# Altium project BLDCControllerDev.PrjPcb
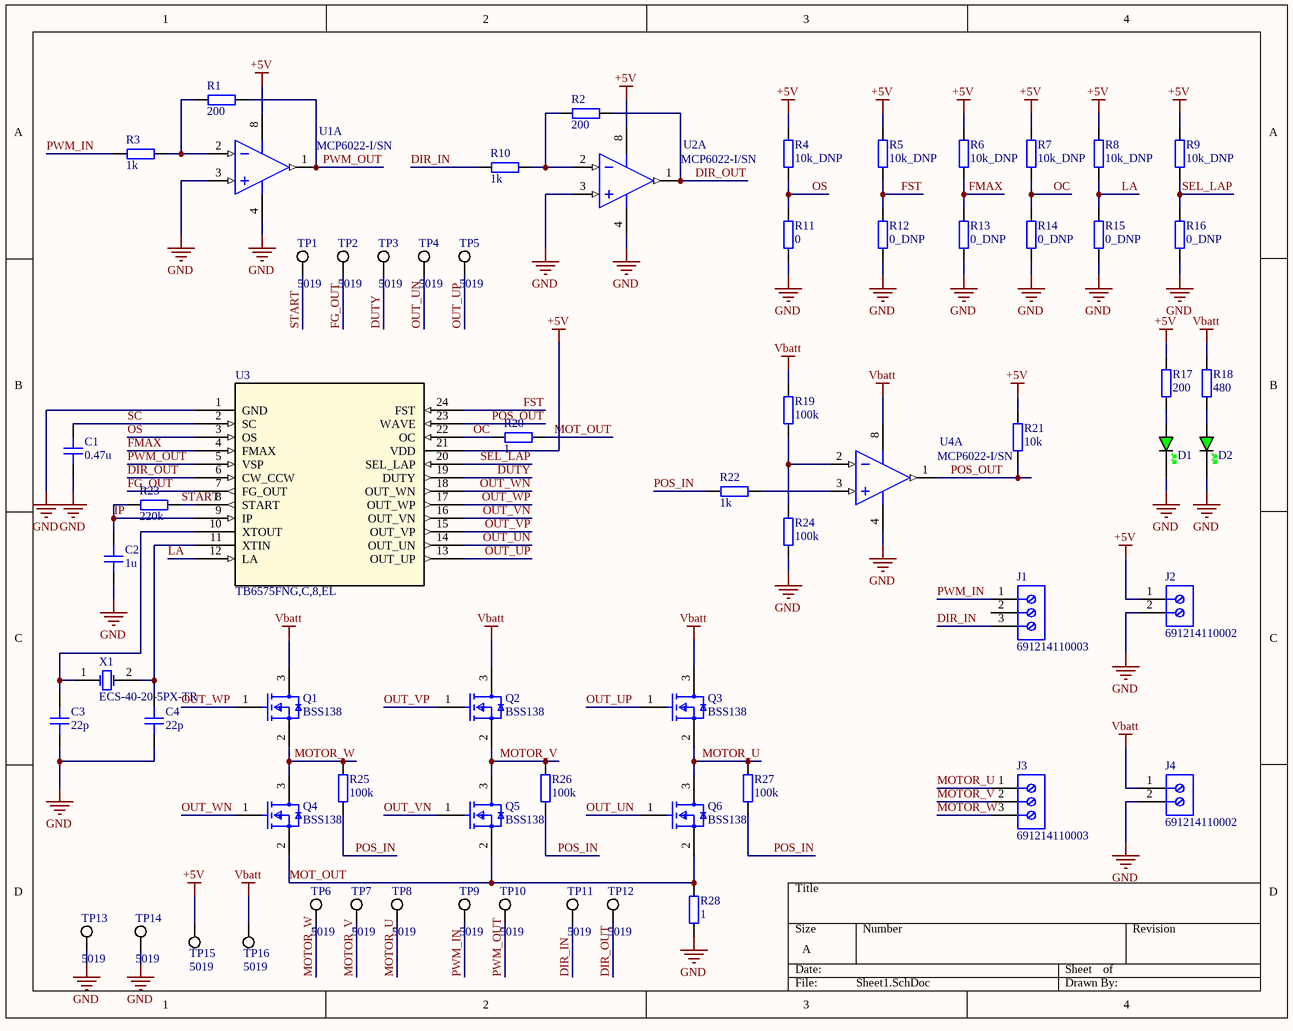
[diagram p0: Sheet1.SchDoc]
1 sheet, 65 parts. Net scope: global (net labels, ports and power ports of the same name join across sheets).
Board file: BLDC.PcbDoc

## Sheet Sheet1.SchDoc
size A; SheetNumber: 1; SheetTotal: 1; SPICEModelCacheHQCTBZKL: <root> / <DocumentId>HQCTBZKL</DocumentId> / <CacheFrame Number="0"> / <Model Name="mcp6021" Kind="CKT"> / <Text>.SUBCKT MCP6021 1 2 3 4 5 / *               | | | | | / *               | | | | Output / *               | | | Negative Supply / *               | | Positive Supply / *               | Inverting Input / *               Non-inverting Input / * / ******************************************************************************** / * Software License Agreement                                                   * / *                                                                              * / * The software supplied herewith by Microchip Technology Incorporated (the     * / * 'Company') is intended and supplied to you, the Company's customer, for use  * / * soley and exclusively on Microchip products.                                 * / *                                                                              * / * The software is owned by the Company and/or its supplier, and is protected   * / * under applicable copyright laws. All rights are reserved. Any use in         * / * violation of the foregoing restrictions may subject the user to criminal     * / * sanctions under applicable laws, as well as to civil liability for the       * / * breach of the terms and conditions of this license.                          * / *                                                                              * / * THIS SOFTWARE IS PROVIDED IN AN 'AS IS' CONDITION. NO WARRANTIES, WHETHER    * / * EXPRESS, IMPLIED OR STATUTORY, INCLUDING, BUT NOT LIMITED TO, IMPLIED        * / * WARRANTIES OF MERCHANTABILITY AND FITNESS FOR A PARTICULAR PURPOSE APPLY TO  * / * THIS SOFTWARE. THE COMPANY SHALL NOT, IN ANY CIRCUMSTANCES, BE LIABLE FOR    * / * SPECIAL, INCIDENTAL OR CONSEQUENTIAL DAMAGES, FOR ANY REASON WHATSOEVER.     * / ******************************************************************************** / * / * The following op-amps are covered by this model: / *      MCP6021,MCP6021R,MCP6022,MCP6023,MCP6024 / * / * Revision History: / *     REV A: 10-Feb-01, KEB (created model) / *     REV B: 27-Aug-06, HNV (added over temperature, improved output stage, / *                            fixed overdrive recovery time) / *			    (MC_RQ, 27-Aug-06, Level 1.17) / * / * Recommendations: / *      Use PSPICE (other simulators may require translation) / *      For a quick, effective design, use a combination of: data sheet / *            specs, bench testing, and simulations with this macromodel / *      For high impedance circuits, set GMIN=100F in the .OPTIONS statement / * / * Supported: / *      Typical performance for temperature range (-40 to 125) degrees Celsius / *      DC, AC, Transient, and Noise analyses. / *      Most specs, including: offsets, DC PSRR, DC CMRR, input impedance, / *            open loop gain, voltage ranges, supply current, ... , etc. / *      Temperature effects for Ibias, Iquiescent, Iout short circuit / *            current, Vsat on both rails, Slew Rate vs. Temp and P.S. / * / * Not Supported: / *      Chip select (MCP6023) / *      Some Variation in specs vs. Power Supply Voltage / *      Monte Carlo (Vos, Ib), Process variation / *      Distortion (detailed non-linear behavior) / *      Behavior outside normal operating region / * / * Input Stage / V10  3 10 -500M / R10 10 11 690K / R11 10 12 690K / G10 10 11 10 11 288U / G11 10 12 10 12 288U / C11 11 12 0.2P / C12  1  0 6.00P / E12 71 14 POLY(4) 20 0 21 0 26 0 27 0   0 1 1 1 1 / G12 1 0 62 0 1m / M12 11 14 15 15 NMI / G13 1 2 62 0 .08m / M14 12 2 15 15 NMI / G14 2 0 62 0 1m / C14  2  0 6.00P / I15 15 4 225.0U / V16 16 4 -300M / GD16 16 1 TABLE {V(16,1)} ((-100,-1p)(0,0)(1m,1u)(2m,1m)) / V13 3 13 -300M / GD13 2 13 TABLE {V(2,13)} ((-100,-1p)(0,0)(1m,1u)(2m,1m)) / R71  1  0 20.0E12 / R72  2  0 20.0E12 / R73  1  2 20.0E12 / I80  1  2 500E-15 / * / * Noise, PSRR, and CMRR / I20 21 20 423U / D20 20  0 DN1 / D21  0 21 DN1 / G26  0 26 POLY(2) 3 0 4 0   0.00 -31.6U -79.4U / R26 26  0 1 / E271 275 0 1 0 1 / E272 276 0 2 0 1 / R271 275 271 37k / R272 276 272 37k / R273 271 0 1k / R274 272 0 1k / C271 275 271 3p / C272 276 272 3p / G27  0 27 POLY(2) 271 0 272 0  -327U 500U 500U / R27 27  0 1 / * / * Open Loop Gain, Slew Rate / G30  0 30 12 11 1 / R30 30  0 1.00K / G31 0 31 3 4 4 / I31 0 31 DC 76.9 / R31 31  0 1 TC=2.34M,-4.57U / GD31 30 0 TABLE {V(30,31)} ((-100,-1n)(0,0)(1m,0.1)(2m,2)) / G32 32 0 3 4 10 / I32 32 0 DC 65 / R32 32  0 1 TC=1.80M,-3.97U / GD32 0 30 TABLE {V(30,32)} ((-2m,2)(-1m,0.1)(0,0)(100,-1n)) / G33  0 33 30 0 1m / R33  33 0 1K / G34  0 34 33 0 1.00 / R34  34 0 1K / C34  34 0 14U / G37  0 37 34 0 1m / R37  37 0 1K / C37  37 0 6P / G38  0 38 37 0 1m / R38  39 0 1K / L38  38 39 31U / E38  35 0 38 0 1 / G35 33 0 TABLE {V(35,3)} ((-1,-1n)(0,0)(50.0,1n))(55.0,1)) / G36 33 0 TABLE {V(35,4)} ((-55.0,-1)((-50.0,-1n)(0,0)(1,1n)) / * / * Output Stage / R80 50 0 100MEG / G50 0 50 57 96 2 / R58 57  96 0.50 / R57 57  0 500 / C58  5  0 2.00P / G57  0 57 POLY(3) 3 0 4 0 35 0   0 0.75M 0.8M 2.00M / GD55 55 57 TABLE {V(55,57)} ((-2m,-1)(-1m,-1m)(0,0)(10,1n)) / GD56 57 56 TABLE {V(57,56)} ((-2m,-1)(-1m,-1m)(0,0)(10,1n)) / E55 55  0 POLY(2) 3 0 51 0 -1.4M 1 -19.1M / E56 56  0 POLY(2) 4 0 52 0 3.5M 1 -19.0M / R51 51 0 1k / R52 52 0 1k / GD51 50 51 TABLE {V(50,51)} ((-10,-1n)(0,0)(1m,1m)(2m,1)) / GD52 50 52 TABLE {V(50,52)}  ((-2m,-1)(-1m,-1m)(0,0)(10,1n)) / G53  3  0 POLY(1) 51 0  -50.0U 1M / G54  0  4 POLY(1) 52 0  -50.0U -1M / * / * Current Limit / G99 96 5 99 0 1 / R98 0 98 1 TC=3.18M,-842N / G97 0 98 TABLE { V(96,5) } ((-11.0,-23.0M)(-1.00M,-22.7M)(0,0)(1.00M,22.7M)(11.0,23.0M)) / E97 99 0 VALUE { V(98)*((V(3)-V(4))*0.00 + 1.00)} / D98 4 5 DESD / D99 5 3 DESD / * / * Temperature / Voltage Sensitive IQuiscent / R61 0 61 1 TC=2.62M,-1.92U / G61 3 4 61 0 1 / G60 0 61 TABLE {V(3, 4)} / + ((0,0)(900M,9.2U)(1.1,50U)(1.3,240U) / + (2.1,870U)(2.2,900U)(5.5,980U)) / * / * Temperature Sensistive offset voltage / I73 0 70 DC 1uA / R74 0 70 1 TC=3.5 / E75 1 71 70 0 1 / * / * Temp Sensistive IBias / I62 0 62 DC 1uA / R62 0 62 REXP  245U / * / * Models / .MODEL NMI NMOS(L=2.00U W=42.0U KP=20.0U LEVEL=1 ) / .MODEL DESD  D   N=1 IS=1.00E-15 / .MODEL DN1 D   IS=1P KF=12.5F AF=1 / .MODEL REXP RES TCE= 9.16 / .ENDS MCP6021</Text> / </Model> / </CacheFrame> / </root>

### Parts
C1  0.47u  [CAP_0805]
C2  1u  [CAP_0805]
C3  22p  [CAP_0805]
C4  22p  [CAP_0805]
D1  GREEN  [LED_0805_GREEN]  (value not drawn)
D2  GREEN  [LED_0805_GREEN]  (value not drawn)
J1  691214110003  [691214110003]
J2  691214110002  [691214110002]
J3  691214110003  [691214110003]
J4  691214110002  [691214110002]
Q1  BSS138  [FP-318-08-IPC_B]
Q2  BSS138  [FP-318-08-IPC_B]
Q3  BSS138  [FP-318-08-IPC_B]
Q4  BSS138  [FP-318-08-IPC_B]
Q5  BSS138  [FP-318-08-IPC_B]
Q6  BSS138  [FP-318-08-IPC_B]
R1  200  [RES_0805]
R2  200  [RES_0805]
R3  1k  [RES_0805]
R4  10k_DNP  [RES_0805]
R5  10k_DNP  [RES_0805]
R6  10k_DNP  [RES_0805]
R7  10k_DNP  [RES_0805]
R8  10k_DNP  [RES_0805]
R9  10k_DNP  [RES_0805]
R10  1k  [RES_0805]
R11  0  [RES_0805]
R12  0_DNP  [RES_0805]
R13  0_DNP  [RES_0805]
R14  0_DNP  [RES_0805]
R15  0_DNP  [RES_0805]
R16  0_DNP  [RES_0805]
R17  200  [RES_0805]
R18  480  [RES_0805]
R19  100k  [RES_0805]
R20  1  [RES_0805]
R21  10k  [RES_0805]
R22  1k  [RES_0805]
R23  220k  [RES_0805]
R24  100k  [RES_0805]
R25  100k  [RES_0805]
R26  100k  [RES_0805]
R27  100k  [RES_0805]
R28  1  [RES_0805]
TP1  5019  [KSTN-5019_V]
TP2  5019  [KSTN-5019_V]
TP3  5019  [KSTN-5019_V]
TP4  5019  [KSTN-5019_V]
TP5  5019  [KSTN-5019_V]
TP6  5019  [KSTN-5019_V]
TP7  5019  [KSTN-5019_V]
TP8  5019  [KSTN-5019_V]
TP9  5019  [KSTN-5019_V]
TP10  5019  [KSTN-5019_V]
TP11  5019  [KSTN-5019_V]
TP12  5019  [KSTN-5019_V]
TP13  5019  [KSTN-5019_V]
TP14  5019  [KSTN-5019_V]
TP15  5019  [KSTN-5019_V]
TP16  5019  [KSTN-5019_V]
U1  MCP6022-I/SN  [SOIC-SN8_N]  (part A of 2)
U2  MCP6022-I/SN  [SOIC-SN8_N]  (part A of 2)
U3  TB6575FNG,C,8,EL  [SSOP24-P-300-0p65A_TOS]
U4  MCP6022-I/SN  [SOIC-SN8_N]  (part A of 2)
X1  ECS-40-20-5PX-TR  [ABRA-ABLS-14.7456MHZ-B2-T_V]

### Nets
+5V: J2.1 R4.2 R5.2 R6.2 R7.2 R8.2 R9.2 R17.2 R21.2 TP15.1 U1.8(VDD) U2.8(VDD) U3.21(VDD)
GND: C1.1 C2.1 C3.1 C4.1 D1.K D2.K J2.2 J4.2 R11.1 R12.1 R13.1 R14.1 R15.1 R16.1 R24.1 R28.1 TP13.1 TP14.1 U1.3(VINA+) U1.4(VSS) U2.3(VINA+) U2.4(VSS) U3.1(GND) U4.4(VSS)
Vbatt: J4.1 Q1.3(D) Q2.3(D) Q3.3(D) R18.2 R19.2 TP16.1 U4.8(VDD)
DIR_IN: J1.3 R10.1 TP11.1
DIR_OUT: R2.2 TP12.1 U2.1(VOUTA) U3.6(CW_CCW)
DUTY: TP3.1 U3.19(DUTY)
FG_OUT: TP2.1 U3.7(FG_OUT)
FMAX: R6.1 R13.2 U3.4(FMAX)
FST: R5.1 R12.2 U3.24(FST)
IP: C2.2 R23.2 U3.9(IP)
LA: R8.1 R15.2 U3.12(LA)
MOT_OUT: Q4.2(S) Q5.2(S) Q6.2(S) R20.1 R28.2
MOTOR_U: J3.1 Q3.2(S) Q6.3(D) R27.2 TP8.1
MOTOR_V: J3.2 Q2.2(S) Q5.3(D) R26.2 TP7.1
MOTOR_W: J3.3 Q1.2(S) Q4.3(D) R25.2 TP6.1
OC: R7.1 R14.2 R20.2 U3.22(OC)
OS: R4.1 R11.2 U3.3(OS)
OUT_UN: Q6.1(G) TP4.1 U3.14(OUT_UN)
OUT_UP: Q3.1(G) TP5.1 U3.13(OUT_UP)
OUT_VN: Q5.1(G) U3.16(OUT_VN)
OUT_VP: Q2.1(G) U3.15(OUT_VP)
OUT_WN: Q4.1(G) U3.18(OUT_WN)
OUT_WP: Q1.1(G) U3.17(OUT_WP)
POS_IN: R22.1 R25.1 R26.1 R27.1
POS_OUT: R21.1 U3.23(WAVE) U4.1(VOUTA)
PWM_IN: J1.1 R3.1 TP9.1
PWM_OUT: R1.2 TP10.1 U1.1(VOUTA) U3.5(VSP)
SC: C1.2 U3.2(SC)
SEL_LAP: R9.1 R16.2 U3.20(SEL_LAP)
START: R23.1 TP1.1 U3.8(START)
NetC3_2: C3.2 U3.10(XTOUT) X1.1(X1)
NetC4_2: C4.2 U3.11(XTIN) X1.2(X2)
NetD1_A: D1.A R17.1
NetD2_A: D2.A R18.1
NetR1_1: R1.1 R3.2 U1.2(VINA-)
NetR2_1: R2.1 R10.2 U2.2(VINA-)
NetR19_1: R19.1 R24.2 U4.2(VINA-)
NetR22_2: R22.2 U4.3(VINA+)

Not connected (* = marked no-connect by the designer): J1 2

### Library data of the parts
C1-C4 = CAP_0805: Capacitor SMD 0805; Manufacturer: *; Manufacturer Part Number: *; Distributor Link: *; LCSC: *; Rating: *; Dielectric: *
D1 D2 = LED_0805_GREEN: LED 0805 GREEN SMD; Manufacturer: *; Manufacturer Part Number: *; Distributor Link: *; LCSC: *
J1 J3 = CMP-1502-02466-2: NexarPartId: 18818289; Number of Levels: 1; Voltage: 300V; Pitch: 3.5052mm; Stripping Length: -6mm; Number of Positions Per Level: 3; Plating: Brass, Steel; Wire/Cable Gauge: 24AWG; Wire Gauge (Min): 16AWG; Current Rating: 10A; Width: 10.9mm; Length: 7.4mm; Housing Material: Nylon; Height: 12.2mm; Min Operating Temperature: -40°C; Contact Plating: Brass, Tin; Packaging: Box; Color: Blue, Green; Number of Contacts: 3; Number of Pins: 3; Voltage Rating: 300V; Termination: Screw; Lead Pitch: 3.5mm; Max Operating Temperature: 105°C; Mount: Through Hole; Contact Material: Brass; RoHS: Compliant; Wire Gauge (Max): 24AWG; Current: 10A; REACH SVHC: Unknown
J2 J4 = CMP-1502-02464-2: NexarPartId: 18818288; Plating: Brass, Steel; Current: 10A; Pitch: 3.5052mm; Number of Levels: 1; Number of Contacts: 2; Wire Gauge (Min): 16AWG; Voltage: 300V; Wire Gauge (Max): 24AWG; Stripping Length: -6mm; Number of Pins: 2; Number of Rows: 1; REACH SVHC: Unknown; RoHS: Compliant; Housing Material: Nylon; Termination: Screw; Mount: Through Hole; Contact Plating: Brass, Tin; Number of Positions Per Level: 2; Color: Blue, Green; Width: 7.9mm; Voltage Rating: 300V; Length: 7.4mm; Current Rating: 10A; Wire/Cable Gauge: 24AWG; Packaging: Box; Max Operating Temperature: 105°C; Lead Pitch: 3.5mm; Height: 8.7mm; Contact Material: Brass; Min Operating Temperature: -40°C
Q1-Q6 = CMP-07173-000101-1: MOSFET N-CH 50V 220MA SOT-23; Turn-Off Delay Time: 20ns; Element Configuration: Single; Rds On Max: 3.5R; Gate to Source Voltage (Vgs): 20V; Threshold Voltage: 1.3V; Number of Elements: 1; Power Dissipation: 360mW; Rise Time: 9ns; Turn-On Delay Time: 2.5ns; Input Capacitance: 27pF; On-State Resistance: 6R; Lead Free: Lead Free; Length: 2.92mm; Width: 1.3mm; Drain to Source Breakdown Voltage: 50V; Min Operating Temperature: -55°C; REACH SVHC: No SVHC; Packaging: Tape and Reel; Radiation Hardening: No; Height: 0.93mm; Drain to Source Voltage (Vdss): 50V; Current Rating: 220mA; Voltage Rating (DC): 50V; Weight: 0.03g; Continuous Drain Current (ID): 220mA; Number of Pins: 3; Nominal Vgs: 1.3V; Max Power Dissipation: 360mW; Fall Time: 9ns; Drain to Source Resistance: 3.5R; Contact Plating: Tin; Case/Package: SOT-23; Package Quantity: 1; Dual Supply Voltage: 50V; Mount: Surface Mount; Termination: SMD/SMT; Max Operating Temperature: 150°C
R1-R28 = RES_0805: Resistor SMD 0805; Manufacturer: *; Manufacturer Part Number: *; Distributor Link: *; LCSC: *
TP1-TP16 = CMP-1672-00008-1: Test Point, 1 Position SMD, RoHS, Tape and Reel; ComponentLink1Description: Manufacturer URL; Package Quantity: 1000; DatasheetVersion: 03/2014; Packaging: Tape and Reel; ComponentLink2URL: http://www.keyelco.com/product-pdf.cfm?p=1357; ComponentLink1URL: http://www.keyelco.com/; Mount: Surface Mount; Contact Plating: Silver; PackageDescription: 1-Pin Surface Mount Device, Body 3.81 x 2.03 mm; Pins: 1; RoHSCompliant: True; Mounting Technology: Surface Mount; ComponentLink2Description: Datasheet; PackageReference: 5019
U1 U2 U4 = CMP-0187-00284-3: None; Number of Elements: 2; Input Offset Voltage-Max: 500uV; Common Mode Rejection Ratio: 70dB; Amplifier Type: GENERAL PURPOSE; Bandwidth: 10MHz; Min Supply Voltage: 2.5V; Supply Current: 1mA; Power Supply Rejection Ratio (PSRR): 74dB; Voltage Gain: 110dB; Slew Rate: 7V/µs; Output Current: 22mA; Input Bias Current: 150pA; Max Supply Voltage: 5.5V; Mount: Surface Mount; Length: 0.192inch; Width: 0.154inch; Case/Package: SOIC; Height: 0.049inch; Nominal Supply Current: 1mA; Number of Circuits: 2; Number of Pins: 8; Unity Gain Bandwidth Product: 10MHz; Technology: CMOS; Number of Amplifiers: 2; Package Quantity: 100; Harmonic Distortion: 0.00053%; Packaging: Rail/Tube; Gain Bandwidth Product: 10MHz; Max Operating Temperature: 85°C; RoHS Compliant: Yes; Gain: 110dB; Lead Free: Lead Free; Number of Channels: 2; REACH SVHC: No SVHC; Min Operating Temperature: -40°C; Radiation Hardening: No; Input Offset Voltage (Vos): 500uV
U3 = TB6575FNG,C,8,EL: No Description Available; Mfr_Name: Toshiba Electronic Devices & Storage Corp.; RefDes: RefDes; Type: Type
X1 = CMP-2000-05726-1: Low Profile Crystal, 8.0 MHz, +/- 30 ppm, -20 to 70 degC, 2-Pin SMD, RoHS, Tape and Reel; Brand: ABRACON; Case Length: 11.4mm; Frequency Stability: 50PPM; ESR: 80Ohms; Case Height: 4.2mm; Tolerance: 30PPM; Frequency: 8MHz; Case Width: 4.7mm; Load Capacitance: 18pF; Datasheet Version: 04/2011; Termination Style: SMD/SMT; Dimensions: 4.7mmWx11.4mmLx4.2mmH; Packaging: Reel; Manufacturer: ABRACON; Package URL: http://www.abracon.com/Support/PackageDrawing/Resonators/ABLS-2D.pdf; Mounting Technology: SurfaceMount; Package Reference: ABLS-14.7456MHZ-B2-T; Product Category: Crystals; Package Description: 2-Pin Surface Mount Device, Body 11.4 x 4.7 mm; Package / Case: HC-49/US; Mounting Style: SMD/SMT; Operating Temperature Range: -20Cto+70C; Series: ABLS; Factory Pack Quantity: 1000; Datasheet URL: http://www.abracon.com/Resonators/abls.pdf; Manufacturer URL: http://www.abracon.com/; RoHS: Details; Type: LowProfileMicroprocessorCrystal